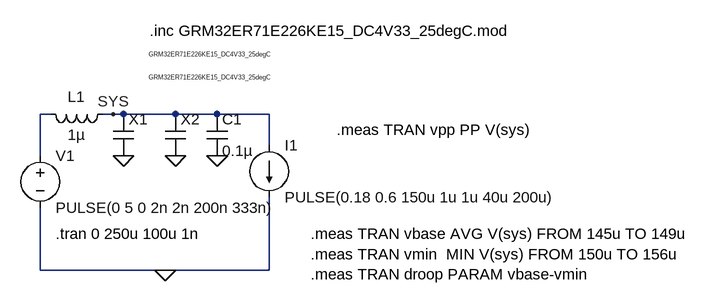
[diagram p0: schematic SYS-output.asc]
SYS-output.asc, the LTspice schematic file:
Version 4.1
SHEET 1 1108 680
WIRE 112 48 96 48
WIRE 208 48 192 48
WIRE 224 48 208 48
WIRE 304 48 224 48
WIRE 368 48 304 48
WIRE 448 48 368 48
WIRE 448 96 448 48
WIRE 96 112 96 48
WIRE 96 288 96 192
WIRE 288 288 96 288
WIRE 448 288 448 176
WIRE 448 288 288 288
FLAG 224 112 0
FLAG 304 112 0
FLAG 288 288 0
FLAG 208 48 SYS
FLAG 368 112 0
SYMBOL voltage 96 96 R0
WINDOW 123 0 0 Left 0
WINDOW 39 0 0 Left 0
SYMATTR InstName V1
SYMATTR Value PULSE(0 5 0 2n 2n 200n 333n)
SYMBOL cap 208 48 R0
WINDOW 3 55 -57 Left 0
SYMATTR InstName X1
SYMATTR Value GRM32ER71E226KE15_DC4V33_25degC
SYMATTR Prefix X
SYMBOL cap 288 48 R0
WINDOW 3 -25 -92 Left 0
SYMATTR InstName X2
SYMATTR Value GRM32ER71E226KE15_DC4V33_25degC
SYMATTR Prefix X
SYMBOL ind 208 32 R90
WINDOW 0 5 56 VBottom 2
WINDOW 3 32 56 VTop 2
SYMATTR InstName L1
SYMATTR Value 1µ
SYMATTR SpiceLine Ipk=2 Rser=96m
SYMBOL cap 352 48 R0
SYMATTR InstName C1
SYMATTR Value 0.1µ
SYMATTR SpiceLine V=25 Irms=0 Rser=0 Lser=0 mfg="Murata" pn="GCM155R71E104KE02" type="X7R"
SYMBOL current 448 96 R0
WINDOW 123 0 0 Left 0
WINDOW 39 0 0 Left 0
SYMATTR InstName I1
SYMATTR Value PULSE(0.18 0.6 150u 1u 1u 40u 200u)
TEXT 120 232 Left 2 !.tran 0 250u 100u 1n
TEXT 552 72 Left 2 !.meas TRAN vpp PP V(sys)
TEXT 264 -80 Left 2 !.inc GRM32ER71E226KE15_DC4V33_25degC.mod
TEXT 512 232 Left 2 !.meas TRAN vbase AVG V(sys) FROM 145u TO 149u\n.meas TRAN vmin  MIN V(sys) FROM 150u TO 156u\n.meas TRAN droop PARAM vbase-vmin

The netlist it stands for:
* SYS-output.asc
V1 N001 0 PULSE(0 5 0 2n 2n 200n 333n)
X§X1 SYS 0 GRM32ER71E226KE15_DC4V33_25degC  ; pins A B
X§X2 SYS 0 GRM32ER71E226KE15_DC4V33_25degC  ; pins A B
L1 SYS N001 1µ Ipk=2 Rser=96m
C1 SYS 0 0.1µ V=25 Irms=0 Rser=0 Lser=0 mfg="Murata" pn="GCM155R71E104KE02" type="X7R"
I1 SYS 0 PULSE(0.18 0.6 150u 1u 1u 40u 200u)
.tran 0 250u 100u 1n
.meas TRAN vpp PP V(sys)
.inc GRM32ER71E226KE15_DC4V33_25degC.mod
.meas TRAN vbase AVG V(sys) FROM 145u TO 149u
.meas TRAN vmin  MIN V(sys) FROM 150u TO 156u
.meas TRAN droop PARAM vbase-vmin
.backanno
.end

* Results of the author's LTspice run, read from the files saved beside the schematic
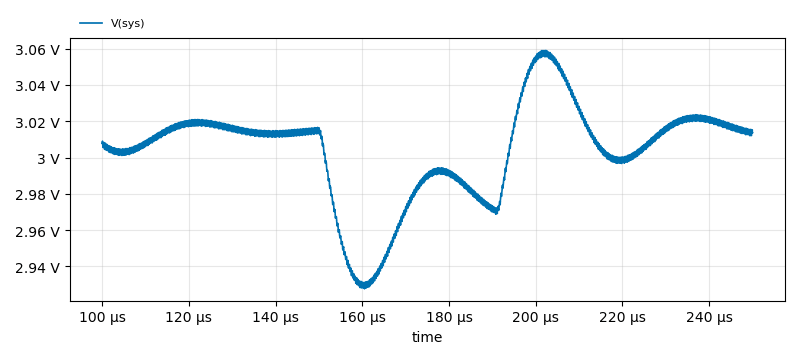
[diagram p1: Transient Analysis of SYS-output.asc, plotted from the saved traces]
* Transient Analysis, 1 run:
*   V(sys): min 2.928 V, max 3.059 V, average 3.004 V, rms 3.004 V, last 3.013 V